# Altium schematic sheet usbtouart.SchDoc
size A4; SheetNumber: 6; SheetTotal: 6
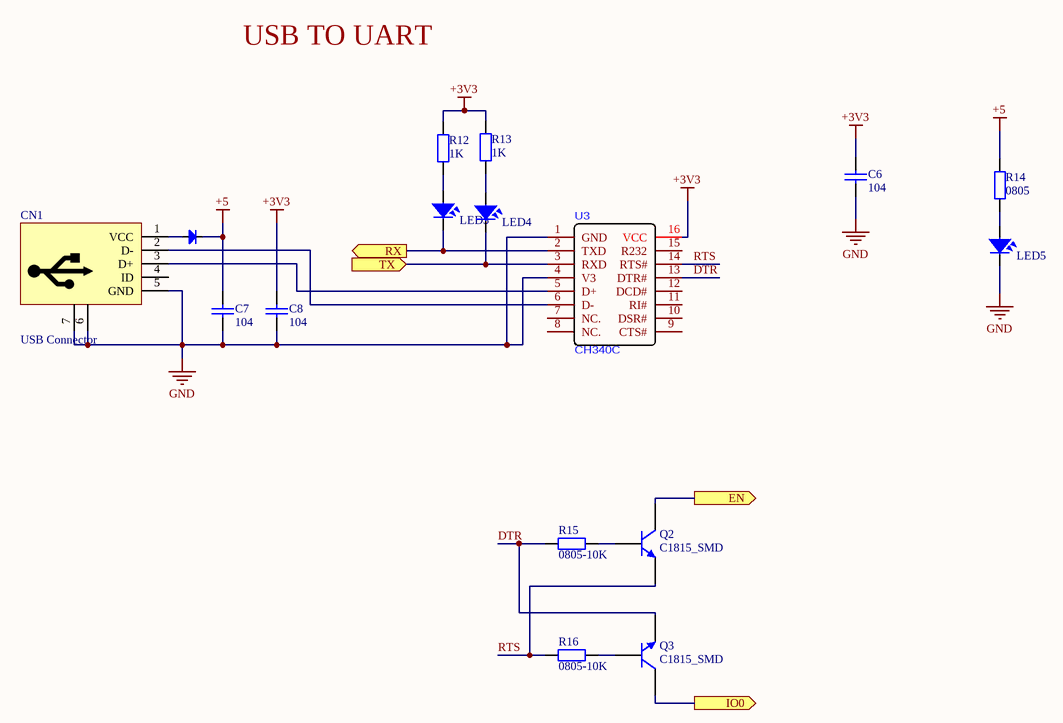
[diagram p0: usbtouart.SchDoc]

## Parts
C6  104  [0805]
C7  104  [0805]
C8  104  [0805]
CN1  USB Connector  [USB-B-Micro-Hole]
DIO1  Diode SMD  [DIO-SMD-106]  (value not drawn)
LED3  LED  [LED-0805-Red]  (value not drawn)
LED4  LED  [LED-0805-Red]  (value not drawn)
LED5  LED  [LED-0805-Orange]  (value not drawn)
Q2  C1815_SMD  [SOT23]
Q3  C1815_SMD  [SOT23]
R12  value 1K  [DIEN TRO 0805]  (hidden comment: R0805)
R13  value 1K  [DIEN TRO 0805]  (hidden comment: R0805)
R14  value 0805  [DIEN TRO 0805]  (hidden comment: R0805)
R15  value 0805-10K  [DIEN TRO 0805]  (hidden comment: R0805)
R16  value 0805-10K  [DIEN TRO 0805]  (hidden comment: R0805)
U3  CH340C  [SOP-16_L10.0-W3.9-P1.27-LS6.0-BL]

## Ports
EN (out), IO0 (out), RX (out), TX (in)

## Nets
+3V3: C6.2 C8.2 R12.2 R13.2 U3.16(VCC)
+5: C7.2 DIO1.2(K) R14.2
GND: C6.1 C7.1 C8.1 CN1.5(GND) CN1.6(SHIELD) CN1.7(SHIELD) LED5.2 U3.1(GND) U3.4(V3)
DTR: Q3.2(E) R15.1 U3.13(DTR#)
EN: Q2.3(C) ; port EN
IO0: Q3.3(C) ; port IO0
RTS: Q2.2(E) R16.1 U3.14(RTS#)
RX: LED3.2 U3.2(TXD) ; port RX
TX: LED4.2 U3.3(RXD) ; port TX
NetCN1_1: CN1.1(VCC) DIO1.1(A)
NetCN1_2: CN1.2(D-) U3.6(D-)
NetCN1_3: CN1.3(D+) U3.5(D+)
NetLED3_1: LED3.1 R12.1
NetLED4_1: LED4.1 R13.1
NetLED5_1: LED5.1 R14.1
NetQ2_1: Q2.1(B) R15.2
NetQ3_1: Q3.1(B) R16.2

Not connected (* = marked no-connect by the designer): CN1 4(ID); U3 7(NC.) 8(NC.) 9(CTS#) 10(DSR#) 11(RI#) 12(DCD#) 15(R232)

## Notes on the sheet
- USB TO UART

## Library data of the parts
C6-C8 = Cap 104_SMD: Capacitor (Semiconductor SIM Model); Value: 0.1uF; Published: 8-Jun-2000; LatestRevisionDate: 17-Jul-2002; LatestRevisionNote: Re-released for DXP Platform.; PackageReference: C1206; Publisher: Altium Limited
CN1 = USB_MICRO_TYPE_B
DIO1 = Diode SMD: Default Diode; Code - JEDEC: DO-214-AB; Value: 1N5007; Published: 8-Jun-2000; Revision: July-2002: Re-released for DXP Platform.; Publisher: Altium Limited
LED3-LED5 = LED SMD: Value: LED 3 - 5 ly 2 Colour
Q2 Q3 = C1815_SMD: NPN General Purpose Amplifier; Published: 8-Jun-2000; LatestRevisionDate: 15-Jan-2003; LatestRevisionNote: PCB Footprint 'BCY-W3/D4.7' replaced; DatasheetVersion: 1997; PackageVersion: Sep-1998; PackageReference: TO-92A; Publisher: Altium Limited; Code_JEDEC: TO-92A; ComponentLink1Description: Manufacturer Link; ComponentLink1URL: http://www.fairchildsemi.com/; ComponentLink2Description: Datasheet; ComponentLink2URL: http://www.fairchildsemi.com/ds/2N%2F2N3904.pdf
R12-R16 = R0805: Resistor SMD 0805; Published: 8-Jun-2000; LatestRevisionDate: 17-Jul-2002; LatestRevisionNote: Re-released for DXP Platform.; PackageReference: AXIAL-0.4; Publisher: Altium Limited